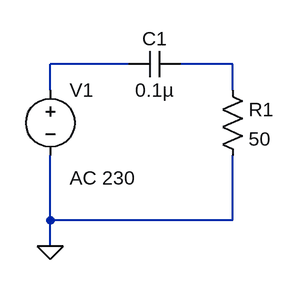
[diagram p0: schematic Draft1.asc]
Draft1.asc, the LTspice schematic file:
Version 4
SHEET 1 880 680
WIRE 176 128 80 128
WIRE 304 128 240 128
WIRE 80 160 80 128
WIRE 304 160 304 128
WIRE 80 320 80 240
WIRE 304 320 304 240
WIRE 304 320 80 320
WIRE 80 352 80 320
FLAG 80 352 0
SYMBOL cap 240 112 R90
WINDOW 0 0 32 VBottom 2
WINDOW 3 32 32 VTop 2
SYMATTR InstName C1
SYMATTR Value 0.1µ
SYMBOL res 288 144 R0
SYMATTR InstName R1
SYMATTR Value 50
SYMBOL voltage 80 144 R0
WINDOW 123 24 124 Left 2
WINDOW 39 0 0 Left 2
SYMATTR InstName V1
SYMATTR Value ""
SYMATTR Value2 AC 230

The netlist it stands for:
* Draft1.asc
C1 N002 N001 0.1µ
R1 N002 0 50
V1 N001 0 AC 230
.backanno
.end